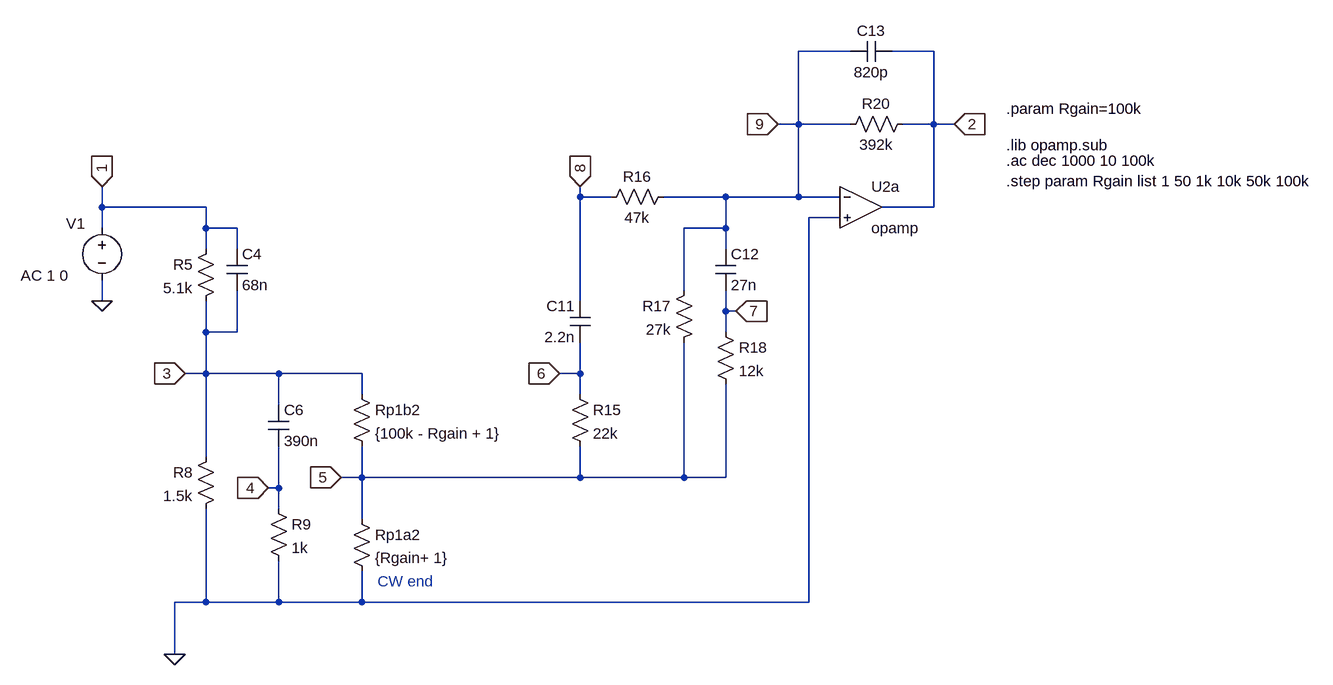
[diagram p0: schematic Klon-Centaur_sum_path_B_v1.asc]
Klon-Centaur_sum_path_B_v1.asc, the LTspice schematic file:
Version 4
SHEET 1 4496 5064
WIRE 784 2320 704 2320
WIRE 912 2320 848 2320
WIRE 704 2432 704 2320
WIRE 704 2432 672 2432
WIRE 784 2432 704 2432
WIRE 912 2432 912 2320
WIRE 912 2432 864 2432
WIRE 944 2432 912 2432
WIRE 368 2544 368 2528
WIRE 416 2544 368 2544
WIRE 592 2544 496 2544
WIRE 704 2544 704 2432
WIRE 704 2544 592 2544
WIRE 768 2544 704 2544
WIRE -368 2560 -368 2528
WIRE -208 2560 -368 2560
WIRE 912 2560 912 2432
WIRE 912 2560 832 2560
WIRE 768 2576 720 2576
WIRE -368 2592 -368 2560
WIRE -208 2592 -208 2560
WIRE -160 2592 -208 2592
WIRE 592 2592 592 2544
WIRE 592 2592 528 2592
WIRE -208 2624 -208 2592
WIRE -160 2624 -160 2592
WIRE 592 2624 592 2592
WIRE 528 2688 528 2592
WIRE -368 2704 -368 2672
WIRE 368 2704 368 2544
WIRE 592 2720 592 2688
WIRE 608 2720 592 2720
WIRE -208 2752 -208 2704
WIRE -160 2752 -160 2688
WIRE -160 2752 -208 2752
WIRE 592 2752 592 2720
WIRE -208 2816 -208 2752
WIRE -208 2816 -240 2816
WIRE -96 2816 -208 2816
WIRE 32 2816 -96 2816
WIRE 368 2816 368 2768
WIRE 368 2816 336 2816
WIRE 32 2848 32 2816
WIRE 368 2848 368 2816
WIRE -96 2864 -96 2816
WIRE -208 2944 -208 2816
WIRE 32 2976 32 2928
WIRE 32 2976 0 2976
WIRE 368 2976 368 2928
WIRE 368 2976 32 2976
WIRE 528 2976 528 2768
WIRE 528 2976 368 2976
WIRE 592 2976 592 2832
WIRE 592 2976 528 2976
WIRE -96 2992 -96 2928
WIRE -96 2992 -112 2992
WIRE -96 3024 -96 2992
WIRE 32 3040 32 2976
WIRE -208 3168 -208 3024
WIRE -208 3168 -256 3168
WIRE -96 3168 -96 3104
WIRE -96 3168 -208 3168
WIRE 32 3168 32 3120
WIRE 32 3168 -96 3168
WIRE 720 3168 720 2576
WIRE 720 3168 32 3168
WIRE -256 3248 -256 3168
FLAG -368 2528 1
IOPIN -368 2528 In
FLAG -256 3248 0
FLAG -368 2704 0
FLAG 368 2528 8
IOPIN 368 2528 In
FLAG 336 2816 6
IOPIN 336 2816 In
FLAG 608 2720 7
IOPIN 608 2720 In
FLAG 0 2976 5
IOPIN 0 2976 In
FLAG -112 2992 4
IOPIN -112 2992 In
FLAG -240 2816 3
IOPIN -240 2816 In
FLAG 672 2432 9
IOPIN 672 2432 In
FLAG 944 2432 2
IOPIN 944 2432 In
SYMBOL voltage -368 2576 R0
WINDOW 0 -55 9 Left 2
WINDOW 123 -125 89 Left 2
WINDOW 39 0 0 Left 0
WINDOW 3 -289 58 Left 2
SYMATTR InstName V1
SYMATTR Value2 AC 1 0
SYMATTR Value ""
SYMBOL res -192 2608 M0
SYMATTR InstName R5
SYMATTR Value 5.1k
SYMBOL res -192 2928 M0
SYMATTR InstName R8
SYMATTR Value 1.5k
SYMBOL cap -176 2624 R0
SYMATTR InstName C4
SYMATTR Value 68n
SYMBOL cap -112 2864 R0
SYMATTR InstName C6
SYMATTR Value 390n
SYMBOL res -112 3008 R0
SYMATTR InstName R9
SYMATTR Value 1k
SYMBOL res 16 2832 R0
SYMATTR InstName Rp1b2
SYMATTR Value {100k - Rgain + 1}
SYMBOL res 16 3024 R0
SYMATTR InstName Rp1a2
SYMATTR Value {Rgain+ 1}
SYMBOL cap 384 2704 M0
SYMATTR InstName C11
SYMATTR Value 2.2n
SYMBOL res 352 2832 R0
SYMATTR InstName R15
SYMATTR Value 22k
SYMBOL res 544 2672 M0
SYMATTR InstName R17
SYMATTR Value 27k
SYMBOL res 576 2736 R0
SYMATTR InstName R18
SYMATTR Value 12k
SYMBOL cap 576 2624 R0
SYMATTR InstName C12
SYMATTR Value 27n
SYMBOL res 512 2528 R90
WINDOW 0 0 56 VBottom 2
WINDOW 3 32 56 VTop 2
SYMATTR InstName R16
SYMATTR Value 47k
SYMBOL res 880 2416 R90
WINDOW 0 0 56 VBottom 2
WINDOW 3 32 56 VTop 2
SYMATTR InstName R20
SYMATTR Value 392k
SYMBOL cap 848 2304 R90
WINDOW 0 0 32 VBottom 2
WINDOW 3 32 32 VTop 2
SYMATTR InstName C13
SYMATTR Value 820p
SYMBOL OpAmps\\opamp 800 2496 R0
SYMATTR InstName U2a
TEXT 1024 2408 Left 2 !.param Rgain=100k
TEXT 1024 2464 Left 2 !.lib opamp.sub
TEXT 1024 2488 Left 2 !.ac dec 1000 10 100k
TEXT 56 3136 Left 2 ;CW end
TEXT 1024 2520 Left 2 !.step param Rgain list 1 50 1k 10k 50k 100k

The netlist it stands for:
* Klon-Centaur_sum_path_B_v1.asc
V1 1 0 AC 1 0
R5 1 3 5.1k
R8 3 0 1.5k
C4 1 3 68n
C6 3 4 390n
R9 4 0 1k
Rp1b2 3 5 {100k - Rgain + 1}
Rp1a2 5 0 {Rgain+ 1}
C11 8 6 2.2n
R15 6 5 22k
R17 9 5 27k
R18 7 5 12k
C12 9 7 27n
R16 9 8 47k
R20 2 9 392k
C13 2 9 820p
XU2a 9 0 2 opamp Aol=100K GBW=10Meg  ; pins invin noninvin out
.param Rgain=100k
.lib opamp.sub
.ac dec 1000 10 100k
* CW end
.step param Rgain list 1 50 1k 10k 50k 100k
.backanno
.end